# Altium schematic sheet 06_ISO_CAN.SchDoc: =GlobalProjectName
size 594 x 420 mm; ApprovedBy: Галкин; CheckedBy: Галкин; Author: Данич; SheetNumber: 6; SheetTotal: 8; PageSetup: Record=PageOptions|CenterHorizontal=True|CenterVertical=True|PrintScale=0.70|XCorrection=1.00|YCorrection=1.00|PrintKind=2|BorderSize=5000000|LeftOffset=9000|BottomOffset=10100|Orientation=2|PaperLength=11176|PaperWidth=8636|Scale=100|PaperSource=259|PrintQuality=-3|MediaType=1|DitherType=10|PrintScaleMode=1|PaperKind=A3|PaperIndex=8
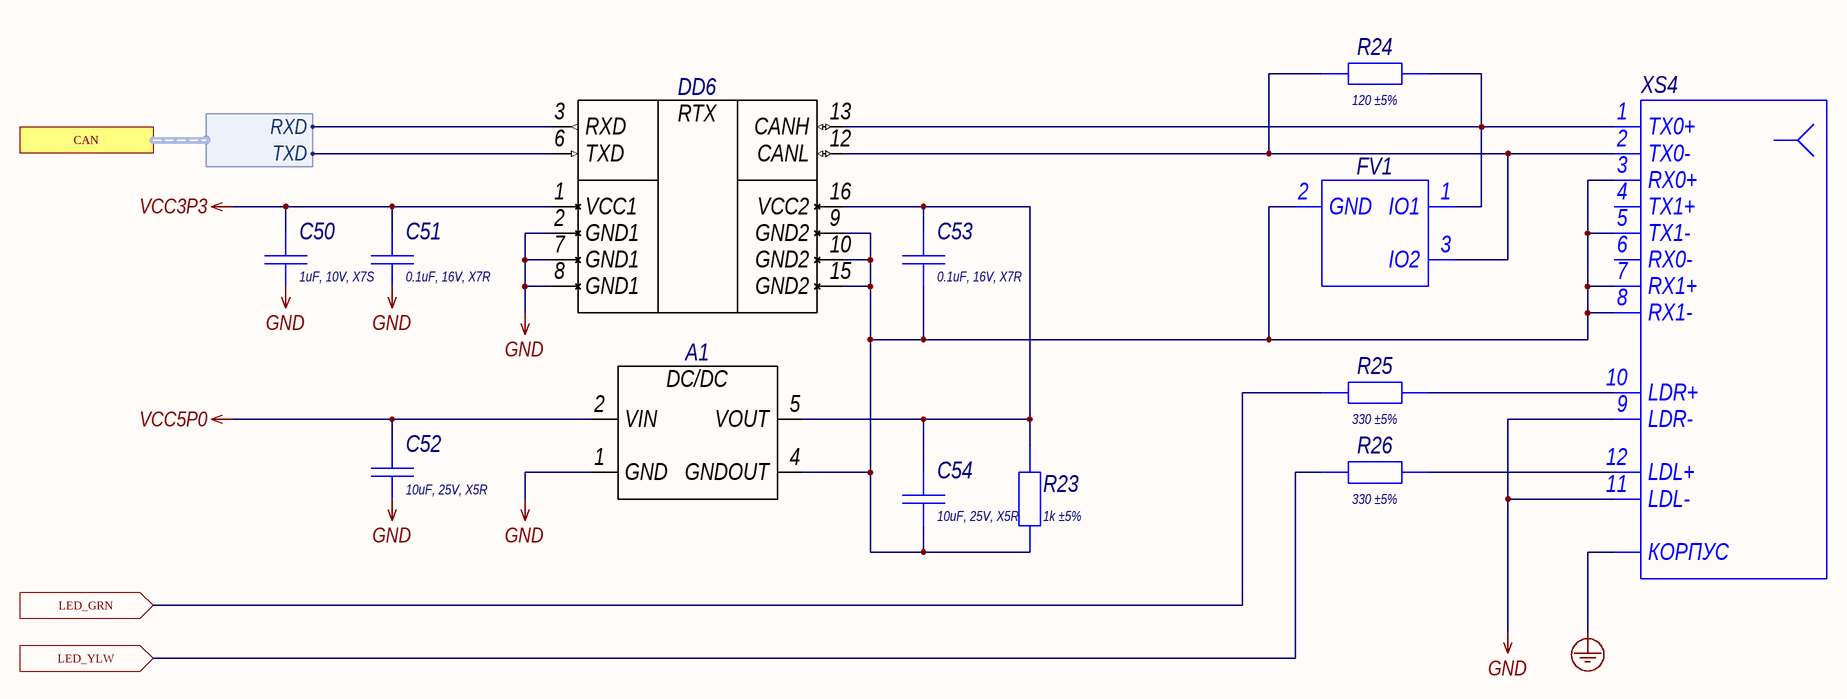
[diagram p0: 06_ISO_CAN.SchDoc]

## Parts
A1  BxxxxXT-1WR3  [BxxxxXT-1WR3]  (value not drawn)
C50  Schematic Value: 1uF, 10V, X7S  [C0402_L]  (hidden comment: Capacitor)
C51  Schematic Value: 0.1uF, 16V, X7R  [C0402_L]  (hidden comment: Capacitor)
C52  Schematic Value: 10uF, 25V, X5R  [C0603_L]  (hidden comment: Capacitor)
C53  Schematic Value: 0.1uF, 16V, X7R  [C0402_L]  (hidden comment: Capacitor)
C54  Schematic Value: 10uF, 25V, X5R  [C0603_L]  (hidden comment: Capacitor)
DD6  ISO1050DW  [SOIC-16_127P1030X750X265_N]  (value not drawn)
FV1  ESDCANxx-2BLY-Series  [SOT-23_190P290X160X145_N]  (value not drawn)
R23  Schematic Value: 1k ±5%  [R0603_L]  (hidden comment: Resistor)
R24  Schematic Value: 120 ±5%  [R0805_L]  (hidden comment: Resistor)
R25  Schematic Value: 330 ±5%  [R0402_L]  (hidden comment: Resistor)
R26  Schematic Value: 330 ±5%  [R0402_L]  (hidden comment: Resistor)
XS4  CAN  [615008137421]  (value not drawn)

## Ports
CAN (harness CAN), LED_GRN (in), LED_YLW (in)

## Harnesses
CAN: RXD, TXD

## Nets
EARTH: XS4.SH(КОРПУС)
GND: A1.1(GND) C50.1 C51.1 C52.1 DD6.2(GND1) DD6.7(GND1) DD6.8(GND1) XS4.9(LDR-) XS4.11(LDL-)
VCC3P3: C50.2 C51.2 DD6.1(VCC1)
VCC5P0: A1.2(VIN) C52.2
LED_GRN: R25.1 ; port LED_GRN
LED_YLW: R26.1 ; port LED_YLW
NetA1_4: A1.4(GNDOUT) C53.1 C54.1 DD6.9(GND2) DD6.10(GND2) DD6.15(GND2) FV1.2(GND) R23.1 XS4.3(RX0+) XS4.5(TX1-) XS4.7(RX1+) XS4.8(RX1-)
NetA1_5: A1.5(VOUT) C53.2 C54.2 DD6.16(VCC2) R23.2
NetDD6_3: DD6.3(RXD) ; port CAN.RXD
NetDD6_6: DD6.6(TXD) ; port CAN.TXD
NetDD6_12: DD6.12(CANL) FV1.3(IO2) R24.1 XS4.2(TX0-)
NetDD6_13: DD6.13(CANH) FV1.1(IO1) R24.2 XS4.1(TX0+)
NetR25_2: R25.2 XS4.10(LDR+)
NetR26_2: R26.2 XS4.12(LDL+)

Not connected (* = marked no-connect by the designer): XS4 4(TX1+) 6(RX0-)

## Notes on the sheet
- Подп. и дата
- Инв. № дубл.
- Взам. инв. №
- Инв. № подл.
- Изм.
- Лист
- № докум.
- Подп.
- Дата
- Форма 2а ГОСТ 2.104-2006
- Копировал
- Формат А2
- (in symbol B0505XT-1WR3) DC/DC
- (in symbol ISO1050DWR) RTX

## Library data of the parts
A1 = B0505XT-1WR3: Manufacturer: Mornsun; ID: 5; Supply Operation: +4.5…5.5V; Output Current Min: +20mA; Output Current Max: +200mA; Output Voltage: +5V; I-O Isolation: 1.5kV; Application Category: 1; Working Temperature Min: -40°С; Working Temperature Max: +105°С; Published: 14.04.2020; Publisher: Andrew Danich; Type: Модуль; Part Number: B0505XT-1WR3; Value: B0505XT-1WR3; Functional Analog: -
C50 = GRM155C71A105KE11D: Manufacturer: Murata; Type: Конденсатор; ID: 179; Value: 1uF; Voltage: 10V; Tolerance: ±10%; Dielectric Type: X7S; Application Category: 1; Working Temperature Min: -55°С; Working Temperature Max: +125°С; Published: 18.05.2010; Publisher: Andrew Danich; Part Number: GRM155C71A105KE11D; Footprint: 0402
C51 C53 = GCM155R71C104KA55D: Manufacturer: Murata; Type: Конденсатор; ID: 163; Value: 0.1uF; Voltage: 16V; Tolerance: ±10%; Dielectric Type: X7R; Application Category: 1; Working Temperature Min: -55°С; Working Temperature Max: +125°С; Functional Analog: GRM155R71C104KA88D; Published: 18.05.2010; Publisher: Andrew Danich; Part Number: GCM155R71C104KA55D; Footprint: 0402
C52 C54 = GRM188R61E106MA73D: Manufacturer: Murata; Type: Конденсатор; ID: 165; Value: 10uF; Voltage: 25V; Tolerance: ±20%; Dielectric Type: X5R; Application Category: 1; Working Temperature Min: -55°С; Working Temperature Max: +85°С; Published: 18.05.2010; Publisher: Andrew Danich; Part Number: GRM188R61E106MA73D; Footprint: 0603
DD6 = ISO1050DWR: Manufacturer: Texas Instruments; ID: 3; Supply Operation: +3.0…5.5V; Supply Current: +70mA; Data Rate: 1Mb/s; Application Type: Transceiver; Input Interface: CAN; Note: Isolated; Application Category: 1; Working Temperature Min: -55°С; Working Temperature Max: +105°С; Published: 14.04.2020; Publisher: Andrew Danich; Type: Микросхема; Part Number: ISO1050DWR; Value: ISO1050DWR; Input Speed: 1Mb/s; Functional Analog: ISO1050DW
FV1 = ESDCAN24-2BLY: Manufacturer: STMicroelectronics; ID: 37; Breakdown Voltage: 27V; Peak Forward Current: 5A; Junction Capacitance: 30pF; Pulse Power Dissipation: 230W; Directional: Bidirectional; Application Category: 1; Working Temperature Min: -40°С; Working Temperature Max: +150°С; Published: 20.05.2020; Publisher: Andrew Danich; Type: Супрессор; Part Number: ESDCAN24-2BLY; Value: ESDCAN24-2BLY
R23 = RC0603JR-071KL: Manufacturer: Yageo; ID: 19; Value: 1k; Limit Voltage: 50V; Tolerance: ±5%; Temperature Coefficient: 100ppm; Total Power Dissipation: 0.1W; Series Type: Thick-Film; Application Category: 1; Working Temperature Min: -55°С; Working Temperature Max: +155°С; Functional Analog: CR0603-JW-102E; Published: 24.03.2010; Publisher: Andrew Danich; Type: Резистор; Part Number: RC0603JR-071KL; Footprint: 0603
R24 = RC0805JR-07120RL: Manufacturer: Yageo; ID: 102; Value: 120; Limit Voltage: 150V; Tolerance: ±5%; Temperature Coefficient: 100ppm; Total Power Dissipation: 0.125W; Series Type: Thick-Film; Application Category: 1; Working Temperature Min: -55°С; Working Temperature Max: +155°С; Published: 24.03.2010; Publisher: Andrew Danich; Type: Резистор; Part Number: RC0805JR-07120RL; Footprint: 0805
R25 R26 = RC0402JR-07330RL: Manufacturer: Yageo; ID: 478; Value: 330; Limit Voltage: 50V; Tolerance: ±5%; Temperature Coefficient: 100ppm; Total Power Dissipation: 0.1W; Series Type: Thick-Film; Application Category: 1; Working Temperature Min: -55°С; Working Temperature Max: +155°С; Published: 24.03.2010; Publisher: Andrew Danich; Type: Резистор; Part Number: RC0402JR-07330RL; Footprint: 0402
XS4 = 615008137421: Manufacturer: Wurth Elektronik; ID: 43; Limit Voltage: 120V; Limit Current: 1.5A; PoE: Yes; Leds: Yellow/Green; Interface: Ethernet/Int.Trans.; Max Data Rate: 1Gbs; Application Category: 1; Working Temperature Min: -40°С; Working Temperature Max: +85°С; Functional Analog: DS1128-09-S8B8S, TJ18-L8P8C-5; Published: 20.05.2020; Publisher: Andrew Danich; Type: Розетка; Part Number: 615008137421; Value: 615008137421; Pins: 12